# Altium project PCB_ProjectTest.PrjPcb
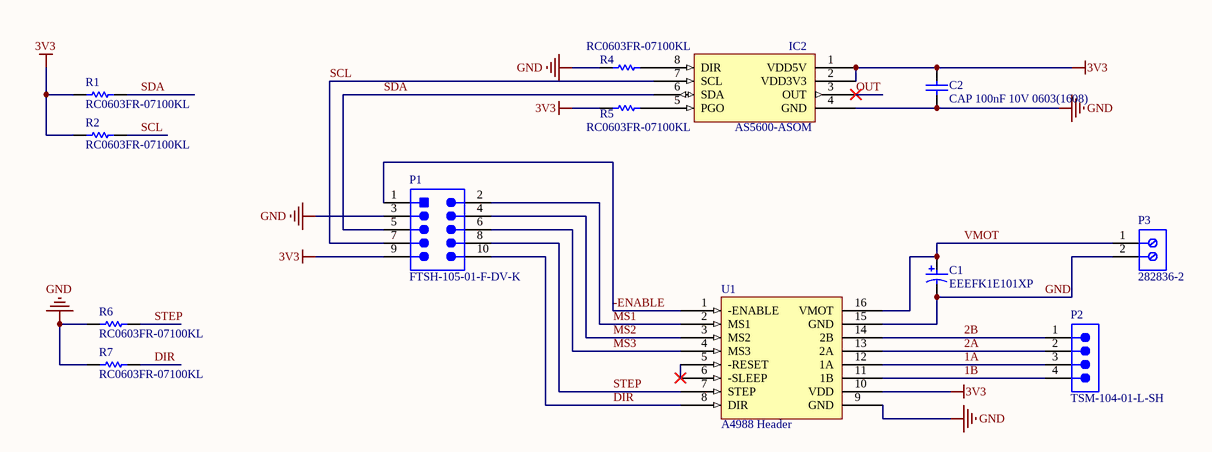
[diagram p0: MotorBoard.SchDoc]
1 sheet, 13 parts. Net scope: global (net labels, ports and power ports of the same name join across sheets).
Board file: MotorBoard.PcbDoc

## Sheet MotorBoard.SchDoc
size B

### Parts
C1  EEEFK1E101XP  [PNSC-FK-V-D8_V]
C2  CAP 100nF 10V 0603(1608)  [CAPC0603(1608)100_M]
IC2  AS5600-ASOM  [SOIC127P600X175-8N]
P1  FTSH-105-01-F-DV-K  [SMTC-FTSH-105-01-L-DV-K_V]
P2  TSM-104-01-L-SH  [SMTC-TSM-104-01-X-SH]
P3  282836-2  [TECO-282836-2_V]
R1  RC0603FR-07100KL  [RESC1608X55X25ML10T15]
R2  RC0603FR-07100KL  [RESC1608X55X25ML10T15]
R4  RC0603FR-07100KL  [RESC1608X55X25ML10T15]
R5  RC0603FR-07100KL  [RESC1608X55X25ML10T15]
R6  RC0603FR-07100KL  [RESC1608X55X25ML10T15]
R7  RC0603FR-07100KL  [RESC1608X55X25ML10T15]
U1  A4988 Header  [A4988 Header-Footprint-1]

### Nets
3V3: C2.2 IC2.1(VDD5V) IC2.2(VDD3V3) P1.9 R1.1 R2.1 R5.1 U1.10(VDD)
GND: C1.2 C2.1 IC2.4(GND) P1.3 P3.2 R4.1 R6.1 R7.1 U1.9(GND) U1.15(GND)
1A: P2.3 U1.12(1A)
1B: P2.4 U1.11(1B)
2A: P2.2 U1.13(2A)
2B: P2.1 U1.14(2B)
-ENABLE: P1.1 U1.1(-ENABLE)
DIR: P1.10 R7.2 U1.8(DIR)
MS1: P1.2 U1.2(MS1)
MS2: P1.4 U1.3(MS2)
MS3: P1.6 U1.4(MS3)
OUT: IC2.3(OUT)
SCL: IC2.7(SCL) P1.7 R2.2
SDA: IC2.6(SDA) P1.5 R1.2
STEP: P1.8 R6.2 U1.7(STEP)
VMOT: C1.1 P3.1 U1.16(VMOT)
NetIC2_5: IC2.5(PGO) R5.2
NetIC2_8: IC2.8(DIR) R4.2
NetU1_5: U1.5(-RESET) U1.6(-SLEEP)

### Notes on the sheet
- THIS DOCUMENT CONTAINS PROPRIETARY INFORMATION AND IS NOT TO BE DISCLOSED OR USED WITHOUT THE DIRECT WRITTEN CONSENT OF BRESSLERGROUP
- CHECKED:
- DRAWN:
- DATE:
- BRESSLER
- group
- 2400 Market St., Suite 1-2
- Philadelphia, Pennsylvania
- 215.561.5100  Voice
- 215.561.5101  Fax
- CLIENT/JOB:
- APPROVED:
- 19103
- USA
- www.bresslergroup.com
- TITLE:
- PART NO.
- DWG NO.
- SHT
- OF
- REV.
- DATE
- BY
- DESCRIPTION

### Library data of the parts
C1 = CMP-2000-06206-1: Aluminum Electrolytic Capacitor, 100 uF, +/- 20%, 25 V, 2-Pin SMD (Size Code D8), -55 to 105 degC, RoHS, Tape and Reel; Manufacturer: Panasonic; Type: Can; Lifetime@Temperature: 2000Hrs@105°C; Capacitance: 100µF; Rated Voltage: 25V; Ripple Current: 280mA; Impedance: 0.34O; Case Size/Dimension: Ø6.3x7.7mm; Operating Temp-Max: 105°C; Series: FK; Package URL: http://industrial.panasonic.com/cdbs/www-data/pdf/RDE0000/DME0000COL48.pdf; Mounting Technology: SurfaceMount; Package Description: 2-Pin Electrolytic Aluminum Capacitor, Body 6.6 x 6.6 mm; Datasheet Version: 03/2016; Datasheet URL: http://industrial.panasonic.com/cdbs/www-data/pdf/RDE0000/ABA0000C1181.pdf; Manufacturer URL: http://www.panasonic.com/; Package Reference: FK-V-D8; Operating Temp Range: -55to+105°C
C2 = CMP-1035-02580-1: CAP 100nF 10V ±10% 0603 (1608 Metric) Thickness 1mm SMD; Tolerance: Â±10%; Case-EIA: 0603; Case-Metric: 1608; Max Thickness: 1 mm; Value: 100nF; Rated Voltage: 10 V; Technology: SMT
IC2 = CMP-00894-4: SENSOR ANGLE 360DEG SMD; Sensing Method: Hall Effect; Mount: Surface Mount; Min Operating Temperature: -40°C; Max Operating Temperature: 125°C; Termination: SMD/SMT; Lead Free: Lead Free
P1 = CMP-2000-05352-1: Male Header, Pitch 1.27 mm, 2 x 5 Position, Height 6.12 mm, RoHS, Tube; Manufacturer: Samtec; Number of Positions: 10; Connector Type: Header,Shrouded; Number of Positions Loaded: All; Row Spacing: 0.050"(1.27mm); System: Connector; Fastening Type: -; Package Reference: FTSH-105-01-L-DV-K; Termination: Solder; Package URL: http://suddendocs.samtec.com/prints/ftsh-1xx-xx-xxx-dv-xxx-footprint.pdf; Number of Rows: 2; Contact Finish Thickness: 3µin(0.08µm); Contact Type: MalePin; Manufacturer URL: http://www.samtec.com/; Contact Mating Length: 0.120"(3.05mm); Pitch: 0.050"(1.27mm); Series: FTSH; Features: -; Contact Finish: Gold; Color: Black; Family: RectangularConnectors-Headers,MalePins; Datasheet URL: http://suddendocs.samtec.com/prints/ftsh-1xx-xx-xxx-dv-xxx-mkt.pdf; Package Description: Male Header, Pitch 1.27 mm, 2 x 5 Position, Height 5.97 mm, Tail Length 4.32 mm; Mounting Type: SurfaceMount; Datasheet Version: Rev. ET, 10/1995; Category: Connectors,Interconnects; Packaging: Tube
P2 = CMP-1024-00225-1: 0.025" SQ Post Header, Surface Mount, Horizontal, -55 to 125 degC, 2.54 mm Pitch, 4-Pin, Male, RoHS; Manufacturer: Samtec; Pitch: 2.54 mm; Orientation: Horizontal; DatasheetVersion: F-214; PackageVersion: CD, 7/1991; Temperature Range: -55 to 125 degC; ComponentLink2URL: http://www.samtec.com/documents/webfiles/pdf/TSM.PDF; ComponentLink3URL: http://www.samtec.com/documents/webfiles/cpdf/TSM-1XX-XX-XXX-SH-XX-XXX-XX-MKT1.pdf; PartNumber: TSM-104-01-L-SH; ComponentLink2Description: Datasheet; ComponentLink3Description: Package Specification; PackageReference: TSM-104-01-X-SH; PackageDescription: Terminal Strip Single Surface Mount; ComponentLink1Description: Manufacturer URL; RoHS: True; Mounting Technology: Surface Mount; ComponentLink1URL: http://www.samtec.com
P3 = CMP-1684-00017-1: Female Header, Pitch 5 mm, 1 x 2 Position, Height 10 mm, Tail Length 3.5 mm, Rohs, Bulk; Manufacturer: TE Connectivity; Wire Gauge: 16-30AWG; Product Training Modules: Wire-to-BoardEurostyleTerminalBlocks; Clamp Material - Plating: Brass-NickelPlated; Voltage: 300V; Mating Orientation: HorizontalwithBoard; Current: 13.5A; Pitch: 0.197"(5.00mm); Screw Thread: M3; 3D Model: 282836-2.pdf; Other Names: 5ULV-02B / A98076; Dynamic Catalog: BuchananSeries; Number of Levels: 1; Torque - Screw: 0.68Nm(6Lb-In); Featured Product: EurostyleTerminalBlockConnectors; Positions Per Level: 2; Wire Termination: Screw-RisingCageClamp; System: Connector; Datasheet URL: http://www.te.com.cn/commerce/DocumentDelivery/DDEController?Action=showdoc&DocId=Catalog+Section%7F1308389_EUROSTYLE_TERMINAL_BLOCKS%7F0607%7Fpdf%7FEnglish%7FENG_CS_1308389_EUROSTYLE_TERMINAL_BLOCKS_0607.pdf%7F282836-2; Color: Green; Family: TerminalBlocks-WiretoBoard; RoHS Information: 282836-2StatementofCompliance; Standard Package: 300; Contact Material - Plating: Brass-TinPlated; Manufacturer URL: http://www.te.com; Housing Material: Polyamide(PA66),Nylon6/6; Features: Interlocking(Side); Package Description: Female Header, Pitch 5 mm, 1 x 2 Position, Height 10 mm, Tail Length 3.5 mm; Mounting Type: ThroughHole; Package Reference: THD; Packaging: Bulk; Series: Buchanan; Category: Connectors,Interconnects; Screw Material - Plating: Brass-NickelPlated
R1 R2 R4-R7 = CMP-2100-03662-1: Chip Resistor, 100 KOhm, +/- 1%, 0.1 W, -55 to 155 degC, 0603 (1608 Metric), RoHS, Tape and Reel; Manufacturer: Yageo; Power Rating: 100mW; Voltage Rating: 50V; Temperature Coefficient: 100ppm/degreesC; Datasheet Version: Rev. 5, 10/2016; Height: 0.45mm; Lead Free: LeadFree; Manufacturer URL: http://www.yageo.com/; Package Reference: 0603; Depth: 0.8mm; RoHSCompliant: true; Composition: ThickFilm; Military Standard: Not; Resistance: 100KOhm; Case/Package: 0603; Packaging: TapeandReel; Case Code (Imperial): 0603; Voltage Rating (DC): 50V; Case Code (Metric): 1608; Tolerance: 1%; Termination: SMD/SMT; Min Operating Temperature: -55degC; Number of Pins: 2; Length: 1.6mm; Width: 0.8mm; Datasheet URL: http://www.yageo.com/NewPortal/yageodocoutput?fileName=/pdf/R-Chip/PYu-RC_Group_51_RoHS_L_5.pdf; Package Description: 2-Pin Surface Mount Device, Body 1.6 x 0.8 mm; Max Operating Temperature: 155degC; REACH SVHC: NoSVHC
U1 = CMP-00889-5: Female Header pins for the A4988 Motor Driver Carrier; Component Name: A4988 Headers; Manufacturer_Part_Number: A4988